# Altium project Dogfish3D.PrjPcb
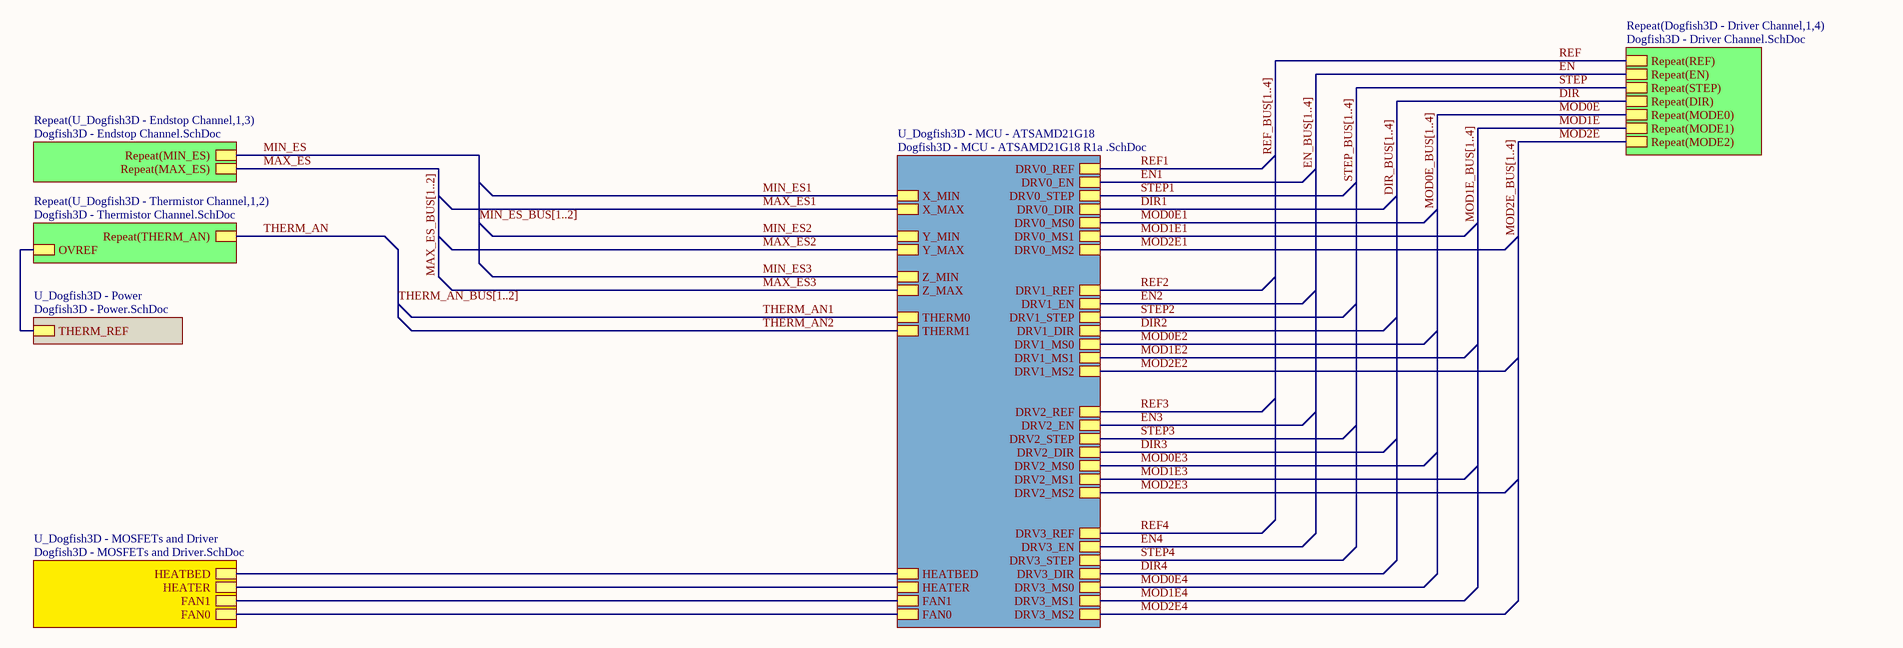
[diagram p0: Dogfish3D - Systyem.SchDoc]
7 sheets, 228 parts. Net scope: hierarchical (ports join the sheet entries above them; power ports are global).
Board file: Dogfish3D R1.0.PcbDoc
Sheets:
  Dogfish3D - Systyem.SchDoc
    Dogfish3D - Driver Channel1 = Dogfish3D - Driver Channel.SchDoc
    Dogfish3D - Driver Channel2 = Dogfish3D - Driver Channel.SchDoc
    Dogfish3D - Driver Channel3 = Dogfish3D - Driver Channel.SchDoc
    Dogfish3D - Driver Channel4 = Dogfish3D - Driver Channel.SchDoc
    U_Dogfish3D - Endstop Channel1 = Dogfish3D - Endstop Channel.SchDoc
    U_Dogfish3D - Endstop Channel2 = Dogfish3D - Endstop Channel.SchDoc
    U_Dogfish3D - Endstop Channel3 = Dogfish3D - Endstop Channel.SchDoc
    U_Dogfish3D - MOSFETs and Driver = Dogfish3D - MOSFETs and Driver.SchDoc
    U_Dogfish3D - Power = Dogfish3D - Power.SchDoc
    U_Dogfish3D - Thermistor Channel1 = Dogfish3D - Thermistor Channel.SchDoc
    U_Dogfish3D - Thermistor Channel2 = Dogfish3D - Thermistor Channel.SchDoc
    U_Dogfish3D - MCU - ATSAMD21G18 = Dogfish3D - MCU - ATSAMD21G18 R1a .SchDoc

## Sheet Dogfish3D - Systyem.SchDoc
size B

### Sub-sheets
Repeat(Dogfish3D - Driver Channel,1,4) = Dogfish3D - Driver Channel.SchDoc: Repeat(REF), Repeat(EN), Repeat(STEP), Repeat(DIR), Repeat(MODE0), Repeat(MODE1), Repeat(MODE2)
Repeat(U_Dogfish3D - Endstop Channel,1,3) = Dogfish3D - Endstop Channel.SchDoc: Repeat(MAX_ES), Repeat(MIN_ES)
Repeat(U_Dogfish3D - Thermistor Channel,1,2) = Dogfish3D - Thermistor Channel.SchDoc: OVREF, Repeat(THERM_AN)
U_Dogfish3D - MCU - ATSAMD21G18 = Dogfish3D - MCU - ATSAMD21G18 R1a .SchDoc: DRV0_EN, DRV0_DIR, DRV0_STEP, DRV0_MS0, DRV0_MS1, DRV0_MS2, DRV0_REF, DRV1_EN, DRV1_DIR, DRV1_STEP, DRV1_MS0, DRV1_MS1, DRV1_MS2, DRV1_REF, DRV2_EN, DRV2_DIR, DRV2_STEP, DRV2_MS0, DRV2_MS1, DRV2_MS2, DRV2_REF, DRV3_EN, DRV3_DIR, DRV3_STEP, DRV3_MS0, DRV3_MS1, DRV3_MS2, DRV3_REF, THERM0, THERM1, X_MAX, X_MIN, Y_MAX, Y_MIN, Z_MAX, Z_MIN, FAN0, FAN1, HEATER, HEATBED
U_Dogfish3D - MOSFETs and Driver = Dogfish3D - MOSFETs and Driver.SchDoc: FAN0, FAN1, HEATER, HEATBED
U_Dogfish3D - Power = Dogfish3D - Power.SchDoc: THERM_REF

### Nets
DIR: sheet Repeat(Dogfish3D - Driver Channel,1,4)/Repeat(DIR)
EN: sheet Repeat(Dogfish3D - Driver Channel,1,4)/Repeat(EN)
MAX_ES: sheet Repeat(U_Dogfish3D - Endstop Channel,1,3)/Repeat(MAX_ES)
MIN_ES: sheet Repeat(U_Dogfish3D - Endstop Channel,1,3)/Repeat(MIN_ES)
MOD0E: sheet Repeat(Dogfish3D - Driver Channel,1,4)/Repeat(MODE0)
MOD1E: sheet Repeat(Dogfish3D - Driver Channel,1,4)/Repeat(MODE1)
MOD2E: sheet Repeat(Dogfish3D - Driver Channel,1,4)/Repeat(MODE2)
PWM0: sheet U_Dogfish3D - MOSFETs and Driver/FAN0, sheet U_Dogfish3D - MCU - ATSAMD21G18/FAN0
PWM1: sheet U_Dogfish3D - MOSFETs and Driver/FAN1, sheet U_Dogfish3D - MCU - ATSAMD21G18/FAN1
PWM2: sheet U_Dogfish3D - MOSFETs and Driver/HEATER, sheet U_Dogfish3D - MCU - ATSAMD21G18/HEATER
PWM3: sheet U_Dogfish3D - MOSFETs and Driver/HEATBED, sheet U_Dogfish3D - MCU - ATSAMD21G18/HEATBED
REF: sheet Repeat(Dogfish3D - Driver Channel,1,4)/Repeat(REF)
STEP: sheet Repeat(Dogfish3D - Driver Channel,1,4)/Repeat(STEP)
THERM_AN: sheet Repeat(U_Dogfish3D - Thermistor Channel,1,2)/Repeat(THERM_AN)
NetD3A_2: sheet U_Dogfish3D - Power/THERM_REF, sheet Repeat(U_Dogfish3D - Thermistor Channel,1,2)/OVREF

### Buses and harness runs
bus DIR_BUS[1..4]
bus EN_BUS[1..4]
bus MAX_ES_BUS[1..2]
bus MIN_ES_BUS[1..2]
bus MOD0E_BUS[1..4]
bus MOD1E_BUS[1..4]
bus MOD2E_BUS[1..4]
bus REF_BUS[1..4]
bus STEP_BUS[1..4]
bus THERM_AN_BUS[1..2]

## Sheet Dogfish3D - Driver Channel.SchDoc
size A
Used 4 times, as channels Dogfish3D - Driver Channel1, Dogfish3D - Driver Channel2, Dogfish3D - Driver Channel3, Dogfish3D - Driver Channel4. Parts and nets are listed once, with the designators drawn on the sheet.
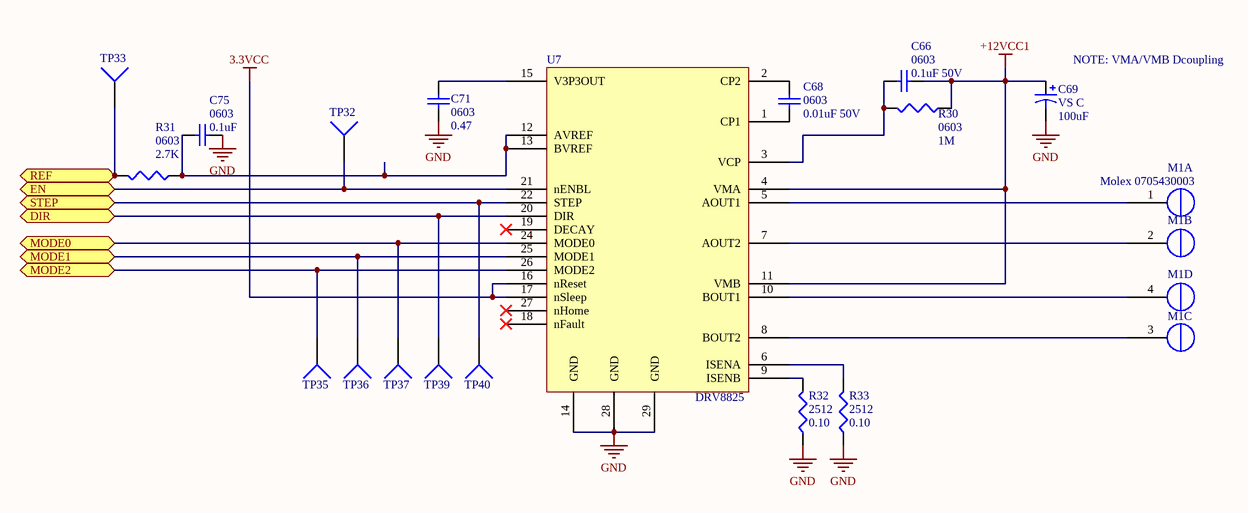
[diagram p1: Dogfish3D - Driver Channel.SchDoc]

### Parts
C66  0603  value 0.1uF 50V  [1608[0603]]
C68  0603  value 0.01uF 50V  [1608[0603]]
C69  VS C  value 100uF  [Panasonic VS C]
C71  0603  value 0.47  [1608[0603]]
C75  0603  value 0.1uF  [1608[0603]]
M1  Molex 0705430003  [4POL254]  (parts A,B,C,D of 4)
R30  0603  value 1M  [J1-0603]
R31  0603  value 2.7K  [J1-0603]
R32  2512  value 0.10  [Resistor2512]
R33  2512  value 0.10  [Resistor2512]
TP32  TP4  [TP-2]  (value not drawn)
TP33  TP4  [TP-2]  (value not drawn)
TP35  TP4  [TP-2]  (value not drawn)
TP36  TP4  [TP-2]  (value not drawn)
TP37  TP4  [TP-2]  (value not drawn)
TP39  TP4  [TP-2]  (value not drawn)
TP40  TP4  [TP-2]  (value not drawn)
U7  DRV8825  [DRV8825]

### Ports
DIR, EN, MODE0, MODE1, MODE2, REF, STEP

### Nets
3.3VCC: U7.16(nReset) U7.17(nSleep)
+12VCC1: C66.1 C69.1 R30.1 U7.4(VMA) U7.11(VMB)
GND: C69.2 C71.1 C75.1 R32.1 R33.1 U7.14(GND) U7.28(GND) U7.29(GND)
DIR: TP39.1 U7.20(DIR) ; port DIR
EN: TP32.1 U7.21(nENBL) ; port EN
MODE0: TP37.1 U7.24(MODE0) ; port MODE0
MODE1: TP36.1 U7.25(MODE1) ; port MODE1
MODE2: TP35.1 U7.26(MODE2) ; port MODE2
REF: R31.2 TP33.1 ; port REF
STEP: TP40.1 U7.22(STEP) ; port STEP
NetC66_2: C66.2 R30.2 U7.3(VCP)
NetC68_1: C68.1 U7.1(CP1)
NetC68_2: C68.2 U7.2(CP2)
NetC71_2: C71.2 U7.15(V3P3OUT)
NetC75_2: C75.2 R31.1 U7.12(AVREF) U7.13(BVREF)
NetM1_1: M1.1(OUT2B) U7.5(AOUT1)
NetM1_2: M1.2(OUT2A) U7.7(AOUT2)
NetM1_3: M1.3(OUT1A) U7.8(BOUT2)
NetM1_4: M1.4(OUT1B) U7.10(BOUT1)
NetR32_2: R32.2 U7.9(ISENB)
NetR33_2: R33.2 U7.6(ISENA)

Not connected (* = marked no-connect by the designer): U7 18(nFault)* 19(DECAY)* 23(NC) 27(nHome)*

### Channels
Dogfish3D - Driver Channel1: designators end in A; ports DIR=DIR1 EN=EN1 MODE0=MOD0E1 MODE1=MOD1E1 MODE2=MOD2E1 REF=REF1 STEP=STEP1
Dogfish3D - Driver Channel2: designators end in B; ports DIR=DIR2 EN=EN2 MODE0=MOD0E2 MODE1=MOD1E2 MODE2=MOD2E2 REF=REF2 STEP=STEP2
Dogfish3D - Driver Channel3: designators end in C; ports DIR=DIR3 EN=EN3 MODE0=MOD0E3 MODE1=MOD1E3 MODE2=MOD2E3 REF=REF3 STEP=STEP3
Dogfish3D - Driver Channel4: designators end in D; ports DIR=DIR4 EN=EN4 MODE0=MOD0E4 MODE1=MOD1E4 MODE2=MOD2E4 REF=E0_DRV_REF STEP=STEP4

### Notes on the sheet
- (near C69) NOTE: VMA/VMB Dcoupling

### Library data of the parts
C66 C68 C71 C75 = Cap Semi: Capacitor (Semiconductor SIM Model); Published: 8-Jun-2000; LatestRevisionDate: 29-May-2009; LatestRevisionNote: IPC-7351 Footprint Added.; PackageReference: C1206; Publisher: Altium Limited; PackageDescription: Chip Capacitor
C69 = Cap Pol1: Polarized Capacitor (Radial); Published: 8-Jun-2000; LatestRevisionDate: 17-Jul-2002; LatestRevisionNote: Re-released for DXP Platform.; PackageReference: RB7.6-15; Publisher: Altium Limited; PackageDescription: Polarized Capacitor (Radial); 2 Leads
M1 = Molex 0705430003 Alt: Molex 4 Pin Clip Connector
R30-R33 = Res3: Resistor; Published: 8-Jun-2000; LatestRevisionDate: 29-May-2009; LatestRevisionNote: IPC-7351 Footprint Added.; PackageReference: J1-0603; Publisher: Altium Limited; PackageDescription: Chip Resistor
TP32 TP33 TP35-TP37 TP39 TP40 = Socket: LatestRevisionDate: 17-Jul-2002; LatestRevisionNote: Re-released for DXP Platform.; Publisher: Altium Limited
U7 = DRV8825: DRV8825 Ti Stepper Driver

## Sheet Dogfish3D - Endstop Channel.SchDoc
size A
Used 3 times, as channels U_Dogfish3D - Endstop Channel1, U_Dogfish3D - Endstop Channel2, U_Dogfish3D - Endstop Channel3. Parts and nets are listed once, with the designators drawn on the sheet.
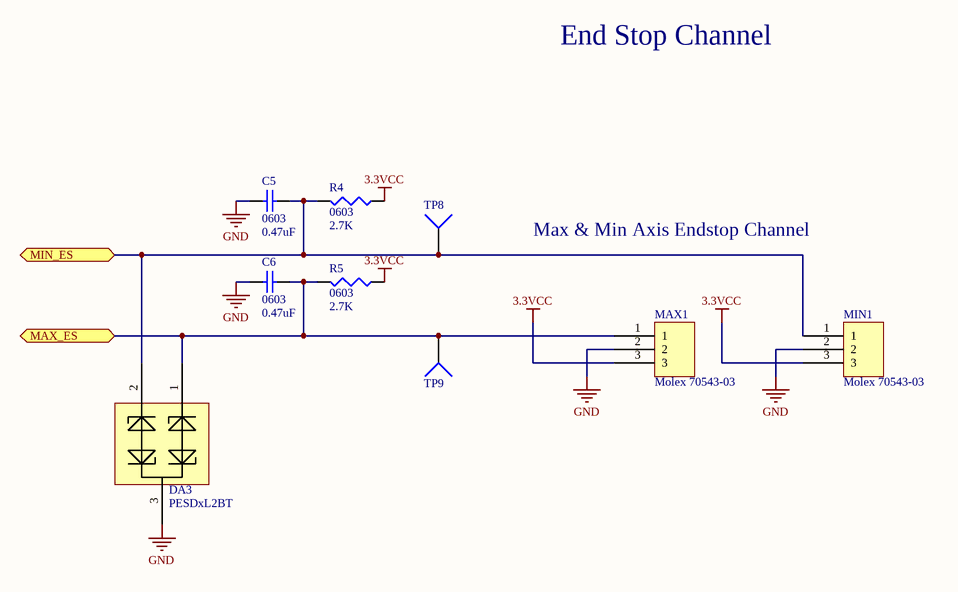
[diagram p2: Dogfish3D - Endstop Channel.SchDoc]

### Parts
C5  0603  value 0.47uF  [1608[0603]]
C6  0603  value 0.47uF  [1608[0603]]
DA3  PESDxL2BT  [SOT95P230X110-3N]
MAX1  Molex 70543-03  [70543-03]
MIN1  Molex 70543-03  [70543-03]
R4  0603  value 2.7K  [J1-0603]
R5  0603  value 2.7K  [J1-0603]
TP8  TP4  [TP-2]  (value not drawn)
TP9  TP4  [TP-2]  (value not drawn)

### Ports
MAX_ES, MIN_ES

### Nets
3.3VCC: MAX1.3 MIN1.3 R4.1 R5.1
GND: C5.2 C6.2 DA3.3 MAX1.2 MIN1.2
MAX_ES: C6.1 DA3.1 MAX1.1 R5.2 TP9.1 ; port MAX_ES
MIN_ES: C5.1 DA3.2 MIN1.1 R4.2 TP8.1 ; port MIN_ES

### Channels
U_Dogfish3D - Endstop Channel1: designators end in A; ports MAX_ES=MAX_ES1 MIN_ES=MIN_ES1
U_Dogfish3D - Endstop Channel2: designators end in B; ports MAX_ES=MAX_ES2 MIN_ES=MIN_ES2
U_Dogfish3D - Endstop Channel3: designators end in C; ports MAX_ES=MAX_ES3 MIN_ES=MIN_ES3

### Notes on the sheet
- End Stop Channel
- Max & Min Axis Endstop Channel

### Library data of the parts
C5 C6 = Cap Semi: Capacitor (Semiconductor SIM Model); Published: 8-Jun-2000; LatestRevisionDate: 29-May-2009; LatestRevisionNote: IPC-7351 Footprint Added.; PackageReference: C1206; Publisher: Altium Limited; PackageDescription: Chip Capacitor
DA3 = PESDxL2BT: PESDxL2BT TVS Diode Array 2x
MAX1 MIN1 = Molex Endstop
R4 R5 = Res3: Resistor; Published: 8-Jun-2000; LatestRevisionDate: 29-May-2009; LatestRevisionNote: IPC-7351 Footprint Added.; PackageReference: J1-0603; Publisher: Altium Limited; PackageDescription: Chip Resistor
TP8 TP9 = Socket: LatestRevisionDate: 17-Jul-2002; LatestRevisionNote: Re-released for DXP Platform.; Publisher: Altium Limited

## Sheet Dogfish3D - MOSFETs and Driver.SchDoc
size A
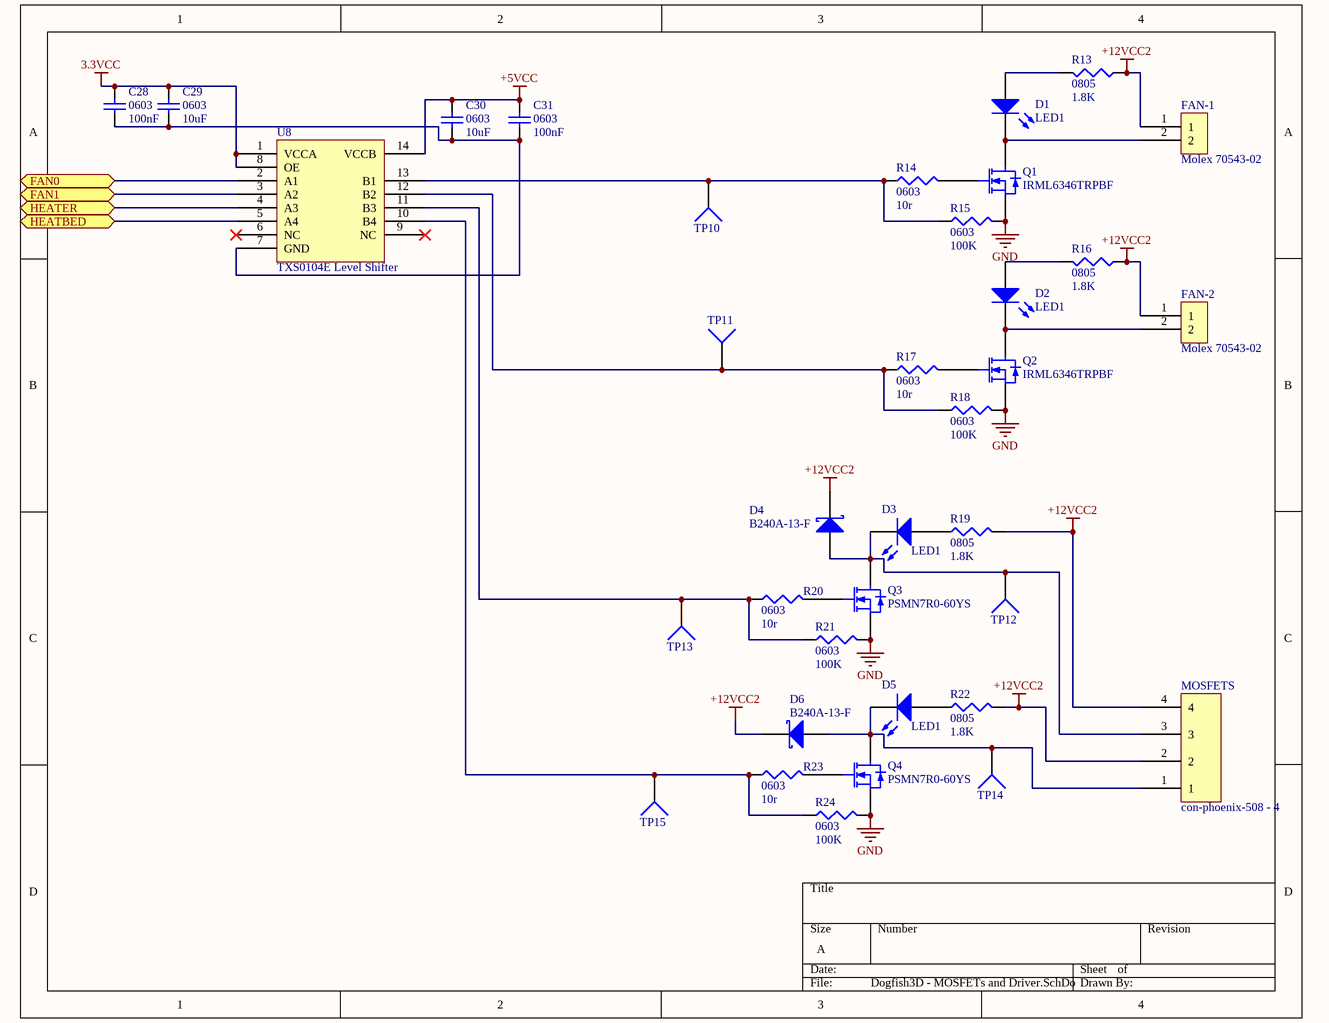
[diagram p3: Dogfish3D - MOSFETs and Driver.SchDoc]

### Parts
(Parts that share a designator on the sheet are numbered #1, #2 ... from top to bottom, then left to right.)
C28  0603  value 100nF  [1608[0603]]
C29  0603  value 10uF  [1608[0603]]
C30  0603  value 10uF  [1608[0603]]
C31  0603  value 100nF  [1608[0603]]
D1  LED1  [SM 0805 polarized]
D2  LED1  [SM 0805 polarized]
D3  LED1  [SM 0805 polarized]
D4  B240A-13-F  [SK310A-TP]
D5  LED1  [SM 0805 polarized]
D6  B240A-13-F  [SK310A-TP]
FAN-1  Molex 70543-02  [70543-02]
FAN-2  Molex 70543-02  [70543-02]
MOSFETS  con-phoenix-508 - 4  [MSTBV4]
Q1  IRML6346TRPBF  [IRLML6346]
Q2  IRML6346TRPBF  [IRLML6346]
Q3  PSMN7R0-60YS  [PSMN7R0-60YS]
Q4  PSMN7R0-60YS  [PSMN7R0-60YS]
R13  0805  value 1.8K  [SM 0805 - gap trimmed]
R14  0603  value 10r  [J1-0603]
R15  0603  value 100K  [J1-0603]
R16  0805  value 1.8K  [SM 0805 - gap trimmed]
R17  0603  value 10r  [J1-0603]
R18  0603  value 100K  [J1-0603]
R19  0805  value 1.8K  [SM 0805 - gap trimmed]
R20  0603  value 10r  [J1-0603]
R21  0603  value 100K  [J1-0603]
R22  0805  value 1.8K  [SM 0805 - gap trimmed]
R23  0603  value 10r  [J1-0603]
R24#1  0603  value 100K  [J1-0603]
TP10  TP4  [TP-2]  (value not drawn)
TP11  TP4  [TP-2]  (value not drawn)
TP12  TP4  [TP-2]  (value not drawn)
TP13  TP4  [TP-2]  (value not drawn)
TP14  TP4  [TP-2]  (value not drawn)
TP15  TP4  [TP-2]  (value not drawn)
U8#1  TXS0104E Level Shifter  [RGY  (S-PVQFN-N14)]

### Ports
FAN0, FAN1, HEATBED, HEATER

### Nets
3.3VCC: C28.2 C29.2 U8#1.1(VCCA) U8#1.8(OE)
+5VCC: C30.2 C31.2 U8#1.14(VCCB)
+12VCC2: D4.2(K) D6.2(K) FAN-1.1 FAN-2.1 MOSFETS.2 MOSFETS.4 R13.1 R16.1 R19.2 R22.2
GND: Q1.2(S) Q2.2(S) Q3.1(S) Q3.2(S) Q3.3(S) Q4.1(S) Q4.2(S) Q4.3(S) R15.2 R18.2 R21.2 R24#1.2
PWM0: U8#1.2(A1) ; port FAN0
PWM1: U8#1.3(A2) ; port FAN1
PWM2: U8#1.4(A3) ; port HEATER
PWM3: U8#1.5(A4) ; port HEATBED
NetC28_1: C28.1 C29.1 C30.1 C31.1 U8#1.7(GND)
NetD1_1: D1.1(A) FAN-1.2 Q1.3(D)
NetD1_2: D1.2(K) R13.2
NetD2_1: D2.1(A) FAN-2.2 Q2.3(D)
NetD2_2: D2.2(K) R16.2
NetD3_1: D3.1(A) D4.1(A) MOSFETS.3 Q3.5(D) TP12.1
NetD3_2: D3.2(K) R19.1
NetD5_1: D5.1(A) D6.1(A) MOSFETS.1 Q4.5(D) TP14.1
NetD5_2: D5.2(K) R22.1
NetQ1_1: Q1.1(G) R14.2
NetQ2_1: Q2.1(G) R17.2
NetQ3_4: Q3.4(G) R20.2
NetQ4_4: Q4.4(G) R23.2
NetR14_1: R14.1 R15.1 TP10.1 U8#1.13(B1)
NetR17_1: R17.1 R18.1 TP11.1 U8#1.12(B2)
NetR20_1: R20.1 R21.1 TP13.1 U8#1.11(B3)
NetR23_1: R23.1 R24#1.1 TP15.1 U8#1.10(B4)

Not connected (* = marked no-connect by the designer): U8#1 6(NC)* 9(NC)*

### Library data of the parts
C28-C31 = Cap Semi: Capacitor (Semiconductor SIM Model); Published: 8-Jun-2000; LatestRevisionDate: 29-May-2009; LatestRevisionNote: IPC-7351 Footprint Added.; PackageReference: C1206; Publisher: Altium Limited; PackageDescription: Chip Capacitor
D1-D3 D5 = LED1: Typical RED GaAs LED; Published: 8-Jun-2000; LatestRevisionDate: 08-Jul-2005; LatestRevisionNote: Mech Layer 1 removed.; PackageReference: LED-1; Publisher: Altium Limited; PackageDescription: LED; 2 Leads
D4 D6 = D Schottky: Schottky Diode; Published: 8-Jun-2000; LatestRevisionDate: 17-Jul-2002; LatestRevisionNote: Re-released for DXP Platform.; PackageReference: SMB; Publisher: Altium Limited; PackageDescription: DO-214-AA/SMB; 2 C-Bend Leads; Body 5.3 x 3.6 mm, inc. leads (LxW); Code_JEDEC: DO-214-AA
MOSFETS = con-phoenix-508_4
Q1 Q2 = IRML6346TRPBF: N-Channel MOSFET; Published: 8-Jun-2000; LatestRevisionDate: 17-Jul-2002; LatestRevisionNote: Re-released for DXP Platform.; PackageVersion: 1995/1996; PackageReference: E3; Publisher: Altium Limited; PackageDescription: TO, Flat Index; 3 In-Line, Axial Leads; Body Dia. 4.6mm; Lead Dia. 0.5 mm (max)
Q3 Q4 = PSMN7R0-60YS: N-Channel MOSFET; Published: 8-Jun-2000; LatestRevisionDate: 17-Jul-2002; LatestRevisionNote: Re-released for DXP Platform.; PackageVersion: 1995/1996; PackageReference: E3; Publisher: Altium Limited; PackageDescription: TO, Flat Index; 3 In-Line, Axial Leads; Body Dia. 4.6mm; Lead Dia. 0.5 mm (max)
R13-R23 R24#1 = Res3: Resistor; Published: 8-Jun-2000; LatestRevisionDate: 29-May-2009; LatestRevisionNote: IPC-7351 Footprint Added.; PackageReference: J1-0603; Publisher: Altium Limited; PackageDescription: Chip Resistor
TP10-TP15 = Socket: LatestRevisionDate: 17-Jul-2002; LatestRevisionNote: Re-released for DXP Platform.; Publisher: Altium Limited
U8#1 = TXS0104E: TXS0104E - Bidriectional Opendrain/pushpull level shift

## Sheet Dogfish3D - Power.SchDoc
size A
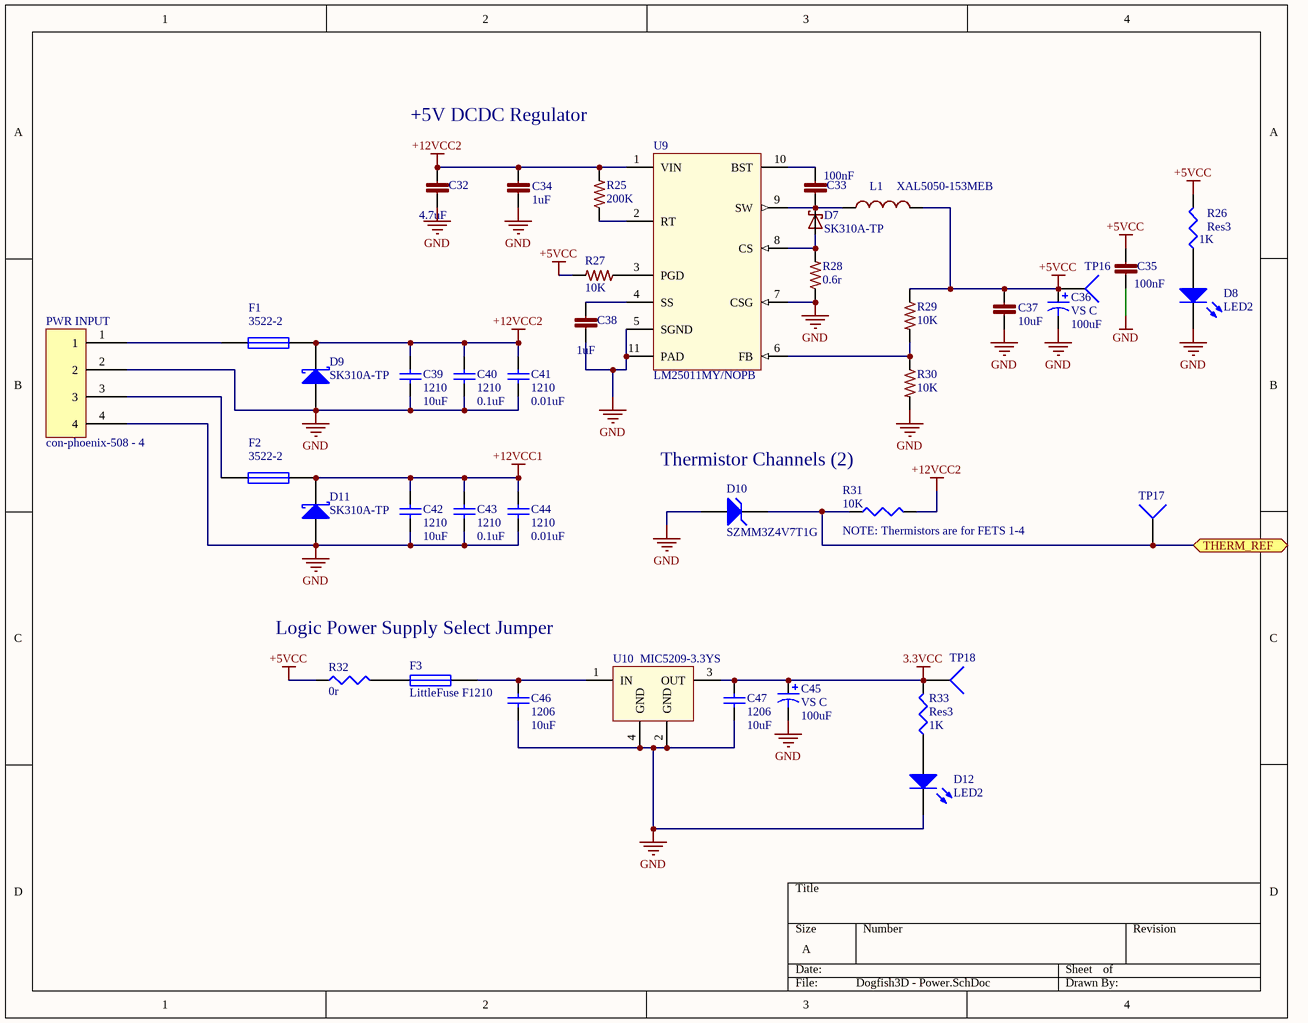
[diagram p4: Dogfish3D - Power.SchDoc]

### Parts
(Parts that share a designator on the sheet are numbered #1, #2 ... from top to bottom, then left to right.)
C32  4.7uF  [C1206]
C33  100nF  [C0603]
C34  1uF  [C0805]
C35#1  100nF  [C0603]
C36#1  VS C  value 100uF  [Panasonic VS C]
C37#1  10uF  [C0805]
C38#1  1uF  [C0402]
C39#1  1210  value 10uF  [C1210]
C40#1  1210  value 0.1uF  [C1210]
C41  1210  value 0.01uF  [C1210]
C42  1210  value 10uF  [C1210]
C43  1210  value 0.1uF  [C1210]
C44  1210  value 0.01uF  [C1210]
C45  VS C  value 100uF  [Panasonic VS C]
C46  1206  value 10uF  [C1206]
C47  1206  value 10uF  [C1206]
D7  SK310A-TP  [SMA-SM]
D8  LED2  [SM 0805 polarized]
D9  SK310A-TP  [SK310A-TP]
D10  SZMM3Z4V7T1G  [SZMM3Z4V7T1G]
D11  SK310A-TP  [SK310A-TP]
D12  LED2  [SM 0805 polarized]
F1  3522-2  [3522-2 - WAVE SOLDER]
F2  3522-2  [3522-2 - WAVE SOLDER]
F3  LittleFuse F1210  [F1210_M]
L1  XAL5050-153MEB  [XAL50xx-153]
PWR_INPUT  con-phoenix-508 - 4  [MSTBV4]
R25  200K  [R0402]
R26  Res3  value 1K  [SM 0805 - gap trimmed]
R27  10K  [R0603]
R28  0.6r  [2512R-0.55]
R29  10K  [R0603]
R30  10K  [R0603]
R31  value 10K  [J1-0603]  (hidden comment: Res3)
R32  value 0r  [SM 0805 - gap trimmed]  (hidden comment: Res3)
R33  Res3  value 1K  [SM 0805 - gap trimmed]
TP16  TP4  [TP-2]  (value not drawn)
TP17  TP4  [TP-2]  (value not drawn)
TP18  TP4  [TP-2]  (value not drawn)
U9#1  LM25011MY/NOPB  [VSSOP10]
U10#1  MIC5209-3.3YS  [SOT230P700X190-4N]

### Ports
THERM_REF

### Nets
3.3VCC: C45.1 C47.2 R33.2 TP18.1 U10#1.3(OUT)
+5VCC: C35#1.1 C36#1.1 C37#1.1 L1.2 R26.2 R27.2 R29.1 R32.1 TP16.1
+12VCC1: C42.2 C43.2 C44.2 D11.2(K) F2.2
+12VCC2: C32.1 C34.1 C39#1.2 C40#1.2 C41.2 D9.2(K) F1.2 R25.2 R31.2 U9#1.1(VIN)
GND: C32.2 C34.2 C35#1.2 C36#1.2 C37#1.2 C38#1.2 C39#1.1 C40#1.1 C41.1 C42.1 C43.1 C44.1 C45.2 C46.1 C47.1 D8.1(A) D9.1(A) D10.1(A) D11.1(A) D12.1(A) PWR_INPUT.2 PWR_INPUT.4 R28.1 R30.2 U9#1.5(SGND) U9#1.7(CSG) U9#1.11(PAD) U10#1.2(GND) U10#1.4(GND)
NetC33_1: C33.1 U9#1.10(BST)
NetC33_2: C33.2 D7.C L1.1 U9#1.9(SW)
NetC38#1_1: C38#1.1 U9#1.4(SS)
NetC46_2: C46.2 F3.1 U10#1.1(IN)
NetD3A_2: D10.2(K) R31.1 TP17.1 ; port THERM_REF
NetD7_A: D7.A R28.2 U9#1.8(CS)
NetD8_2: D8.2(K) R26.1
NetD12_2: D12.2(K) R33.1
NetF1_1: F1.1 PWR_INPUT.1
NetF2_1: F2.1 PWR_INPUT.3
NetF3_2: F3.2 R32.2
NetR25_1: R25.1 U9#1.2(RT)
NetR27_1: R27.1 U9#1.3(PGD)
NetR29_2: R29.2 R30.1 U9#1.6(FB)

### Notes on the sheet
- +5V DCDC Regulator
- Thermistor Channels (2)
- (near R31) NOTE: Thermistors are for FETS 1-4
- Logic Power Supply Select Jumper

### Library data of the parts
C32 = C1206C475K5PACTU: CAP CER 1206 4.7uF 50V 10% X5R; LastRevisionNote: ImportComponents; Published: 23-Apr-2014; Publisher: UltiMachine; LastRevisionDate: 23-Apr-2014; ManufacturerPartNumber: C1206C475K5PACTU; VALUE: 4.7uF
C33 C35#1 = C0603C104K5RACTU: CAP CER 0603 100nF 50V 10% X7R; LastRevisionNote: ImportComponents; Published: 23-Apr-2014; Publisher: UltiMachine; LastRevisionDate: 23-Apr-2014; ManufacturerPartNumber: C0603C104K5RACTU; VALUE: 100nF
C34 = GRM21BR71H105KA12L: CAP CER 0805 1uF 50V 10% X7R; LastRevisionNote: ImportComponents; Published: 23-Apr-2014; Publisher: UltiMachine; LastRevisionDate: 23-Apr-2014; ManufacturerPartNumber: GRM21BR71H105KA12L; VALUE: 1uF
C36#1 C45 = Cap Pol3: Polarized Capacitor (Surface Mount); Published: 8-Jun-2000; LatestRevisionDate: 29-May-2009; LatestRevisionNote: IPC-7351 Footprint Added.; PackageReference: C0805; Publisher: Altium Limited; PackageDescription: Chip Capacitor
C37#1 = C0805C106K8PACTU: CAP CER 0805 10uF 10V 10% X5R; LastRevisionNote: ImportComponents; Published: 23-Apr-2014; Publisher: UltiMachine; LastRevisionDate: 23-Apr-2014; ManufacturerPartNumber: C0805C106K8PACTU; VALUE: 10uF
C38#1 = GRM155R60J105KE19D: CAP CER 0402 1uF 6.3V 10% X5R; LastRevisionNote: ImportComponents; Published: 23-Apr-2014; Publisher: UltiMachine; LastRevisionDate: 23-Apr-2014; ManufacturerPartNumber: GRM155R60J105KE19D; VALUE: 1uF
C39#1 C40#1 C41-C44 C46 C47 = Cap Semi: Capacitor (Semiconductor SIM Model); Published: 8-Jun-2000; LatestRevisionDate: 29-May-2009; LatestRevisionNote: IPC-7351 Footprint Added.; PackageReference: C1206; Publisher: Altium Limited; PackageDescription: Chip Capacitor
D7 = SK310A: DIODE Schottky 3A SMA; LastRevisionNote: ImportComponents; LastRevisionDate: 23-Apr-2014; ManufacturerPartNumber: SK310A; Published: 23-Apr-2014; Publisher: UltiMachine
D8 D12 = LED2: Typical RED, GREEN, YELLOW, AMBER GaAs LED; Published: 8-Jun-2000; LatestRevisionDate: 17-Jul-2002; LatestRevisionNote: Re-released for DXP Platform.; PackageVersion: Feb-2002; PackageReference: 3.2X1.6X1.1; Publisher: Altium Limited; PackageDescription: SM LED; 2 Flat Leads
D9 D11 = D Schottky: Schottky Diode; Published: 8-Jun-2000; LatestRevisionDate: 17-Jul-2002; LatestRevisionNote: Re-released for DXP Platform.; PackageReference: SMB; Publisher: Altium Limited; PackageDescription: DO-214-AA/SMB; 2 C-Bend Leads; Body 5.3 x 3.6 mm, inc. leads (LxW); Code_JEDEC: DO-214-AA
D10 = D Zener: Zener Diode; Published: 8-Jun-2000; LatestRevisionDate: 17-Jul-2002; LatestRevisionNote: Re-released for DXP Platform.; PackageReference: DIODE-0.7; Publisher: Altium Limited; PackageDescription: Diode, Thru-Hole; 2 Leads; 0.7 in Pin Spacing
F1-F3 = Fuse 1: Fuse; Published: 8-Jun-2000; LatestRevisionDate: 17-Jul-2002; LatestRevisionNote: Re-released for DXP Platform.; PackageReference: PIN-W2/E2.8; Publisher: Altium Limited; PackageDescription: Thru-Hole; 2 Leads
L1 = XAL5050-153MEB: IND 15uH 3.9A 20%; LastRevisionNote: ImportComponents; Published: 23-Apr-2014; Publisher: UltiMachine; LastRevisionDate: 23-Apr-2014; ManufacturerPartNumber: XAL5050-153MEB; Value: XAL5050-153MEB
PWR_INPUT = con-phoenix-508_4
R25 = CRCW0402200KFKED: RES 0402 22r 63mW 1%; LastRevisionNote: ImportComponents; Published: 23-Apr-2014; Publisher: UltiMachine; LastRevisionDate: 23-Apr-2014; ManufacturerPartNumber: CRCW0402200KFKED; VALUE: 200K
R26 R31-R33 = Res3: Resistor; Published: 8-Jun-2000; LatestRevisionDate: 29-May-2009; LatestRevisionNote: IPC-7351 Footprint Added.; PackageReference: J1-0603; Publisher: Altium Limited; PackageDescription: Chip Resistor
R27 R29 R30 = ERJ-3EKF1002V: RES 0603 10K 100mW 1%; LastRevisionNote: ImportComponents; Published: 23-Apr-2014; Publisher: UltiMachine; LastRevisionDate: 23-Apr-2014; ManufacturerPartNumber: ERJ-3EKF1002V; VALUE: 10K
R28 = RL2512FK-070R06L: RES 0.06 OHM 1W 1% 2512 SMD; LastRevisionNote: ImportComponents; Published: 23-Apr-2014; Publisher: UltiMachine; LastRevisionDate: 23-Apr-2014; ManufacturerPartNumber: RL2512FK-070R06L; VALUE: 0.6r
TP16-TP18 = Socket: LatestRevisionDate: 17-Jul-2002; LatestRevisionNote: Re-released for DXP Platform.; Publisher: Altium Limited
U9#1 = LM25011: REG BUCK; Value: LM25011MY/NOPB

## Sheet Dogfish3D - Thermistor Channel.SchDoc
size A
Used 2 times, as channels U_Dogfish3D - Thermistor Channel1, U_Dogfish3D - Thermistor Channel2. Parts and nets are listed once, with the designators drawn on the sheet.
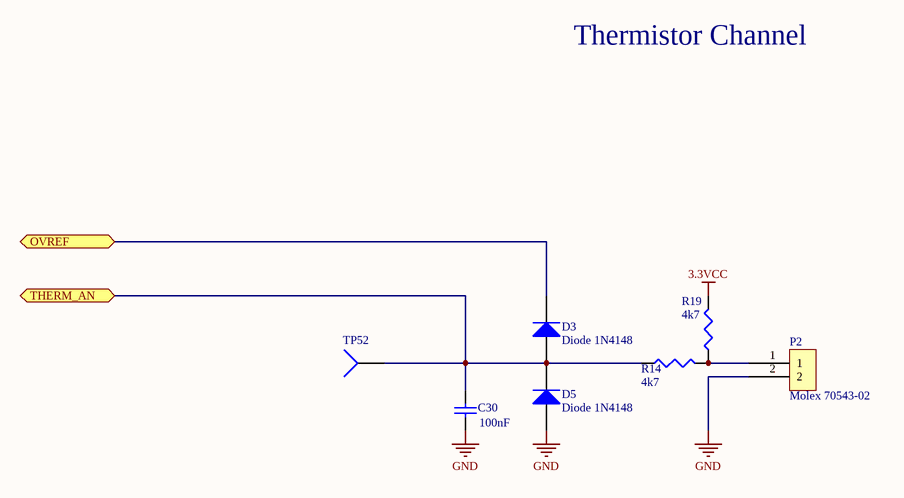
[diagram p5: Dogfish3D - Thermistor Channel.SchDoc]

### Parts
C30  value 100nF  [1608[0603]]  (hidden comment: Cap Semi)
D3  Diode 1N4148  [1N4148WT]
D5  Diode 1N4148  [1N4148WT]
P2  Molex 70543-02  [70543-02]
R14  value 4k7  [J1-0603]  (hidden comment: Res3)
R19  value 4k7  [J1-0603]  (hidden comment: Res3)
TP52  TP4  [TP-2]  (value not drawn)

### Ports
OVREF, THERM_AN

### Nets
3.3VCC: R19.2
GND: C30.1 D5.1(A) P2.2
OVREF: D3.2(K) ; port OVREF
THERM_AN: C30.2 D3.1(A) D5.2(K) R14.1 TP52.1 ; port THERM_AN
NetP2_1: P2.1 R14.2 R19.1

### Channels
U_Dogfish3D - Thermistor Channel1: designators end in A; ports OVREF=NetD3A_2 THERM_AN=THERM_AN1
U_Dogfish3D - Thermistor Channel2: designators end in B; ports OVREF=NetD3A_2 THERM_AN=THERM_AN2

### Notes on the sheet
- Thermistor Channel

### Library data of the parts
C30 = Cap Semi: Capacitor (Semiconductor SIM Model); Published: 8-Jun-2000; LatestRevisionDate: 29-May-2009; LatestRevisionNote: IPC-7351 Footprint Added.; PackageReference: C1206; Publisher: Altium Limited; PackageDescription: Chip Capacitor
D3 D5 = Diode 1N4148: High Conductance Fast Diode; Published: 8-Jun-2000; LatestRevisionDate: 17-Jul-2002; LatestRevisionNote: Re-released for DXP Platform.; DatasheetVersion: 1997; PackageReference: DO-35; Publisher: Altium Limited; PackageDescription: Diode, Axial; Body 3.8 x 1.9 mm (LxDia. max), Lead Dia. 0.53 mm (max); Code_JEDEC: DO-204-AH; ComponentLink1Description: Manufacturer Link; ComponentLink1URL: http://www.fairchildsemi.com/; ComponentLink2Description: Datasheet; ComponentLink2URL: http://www.fairchildsemi.com/ds/1N%2F1N4148.pdf
R14 R19 = Res3: Resistor; Published: 8-Jun-2000; LatestRevisionDate: 29-May-2009; LatestRevisionNote: IPC-7351 Footprint Added.; PackageReference: J1-0603; Publisher: Altium Limited; PackageDescription: Chip Resistor
TP52 = Socket: LatestRevisionDate: 17-Jul-2002; LatestRevisionNote: Re-released for DXP Platform.; Publisher: Altium Limited

## Sheet Dogfish3D - MCU - ATSAMD21G18 R1a .SchDoc
size B
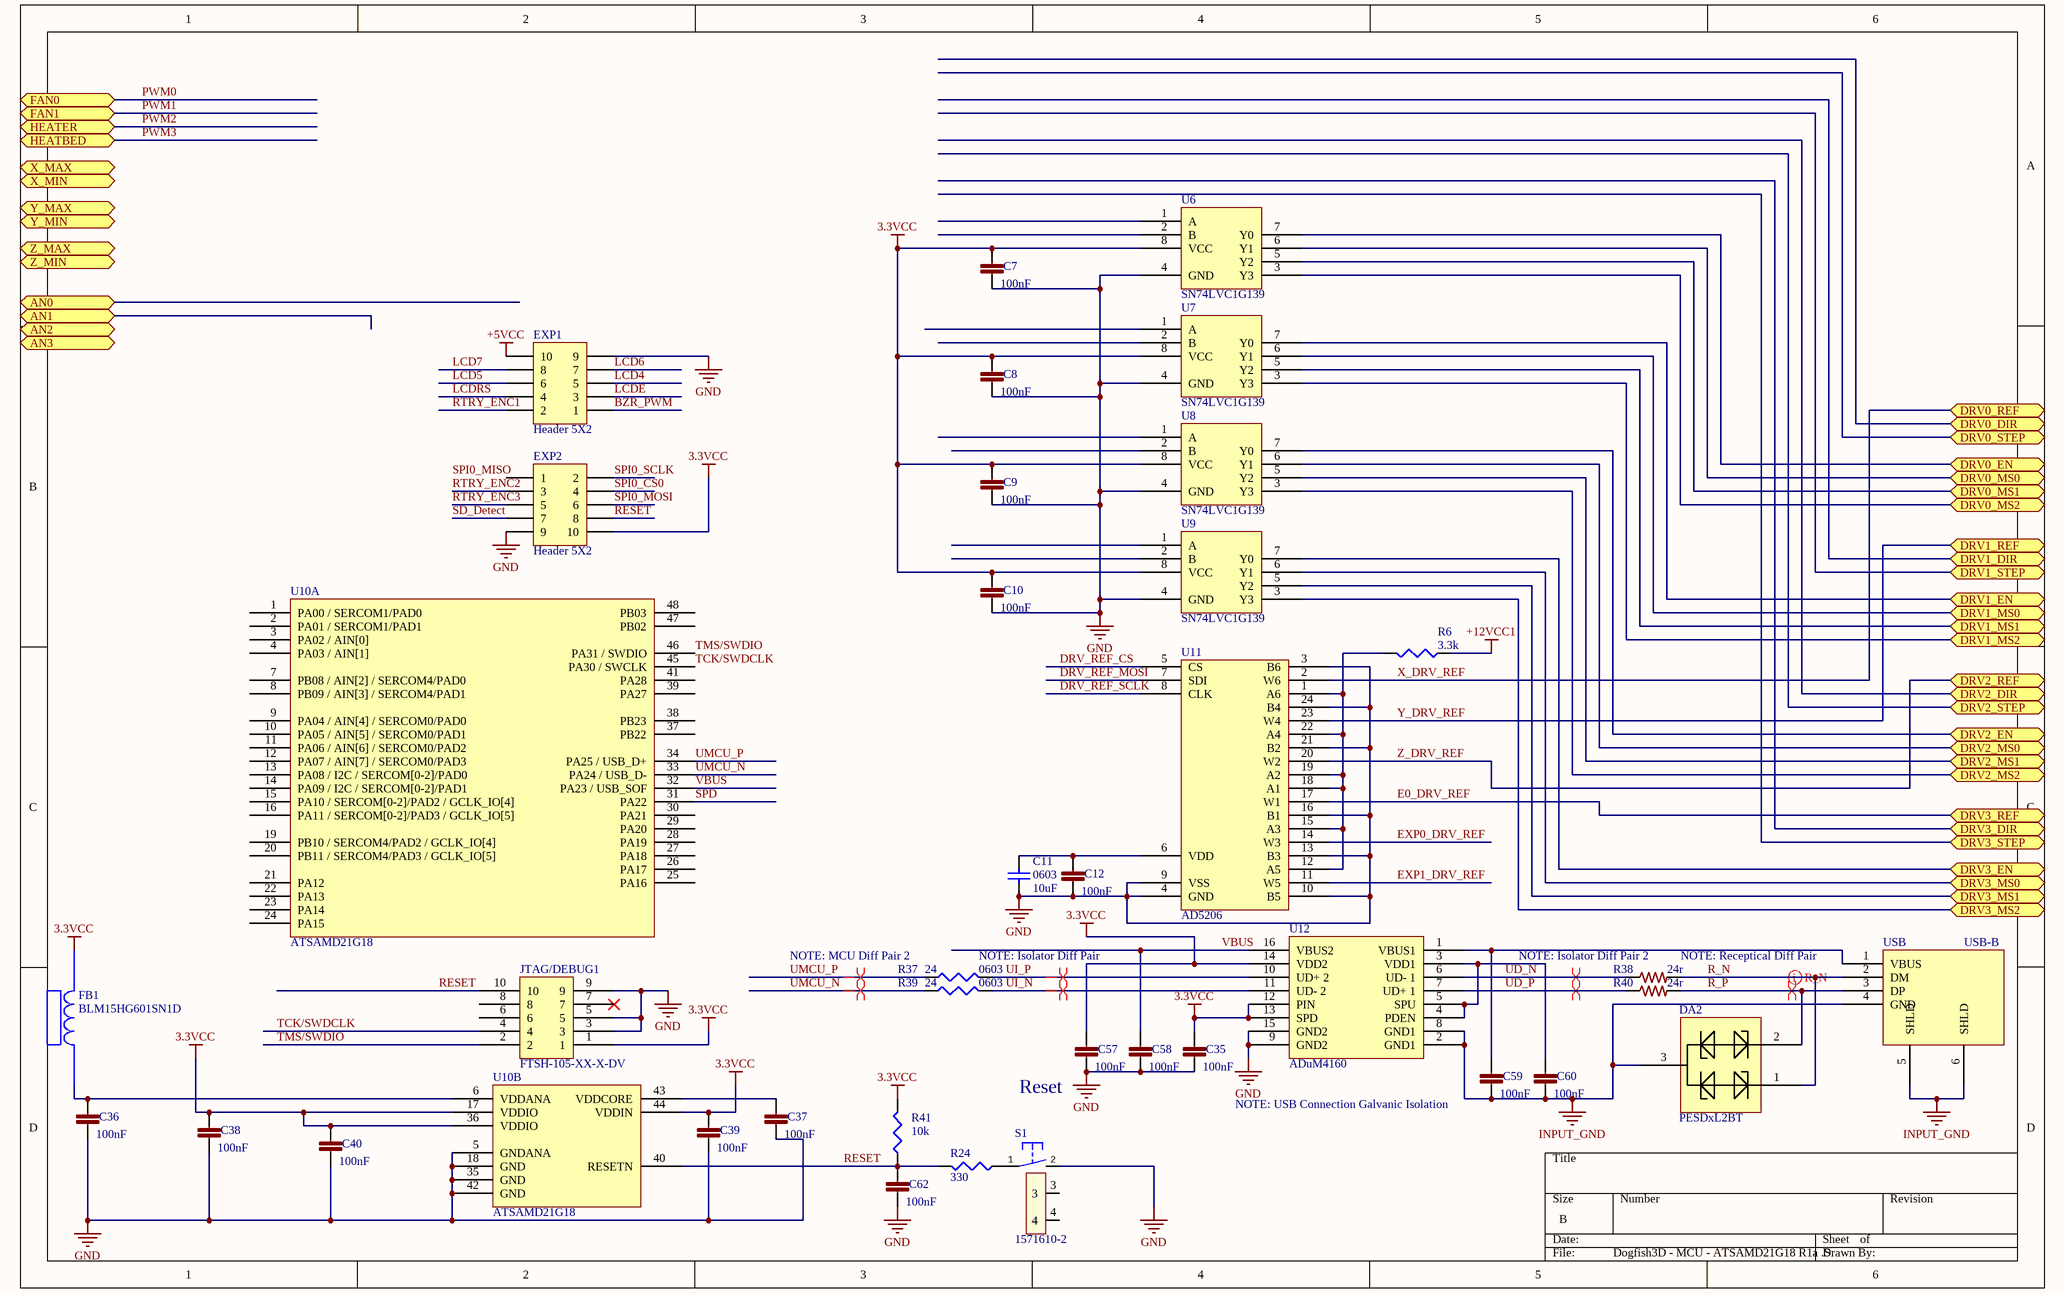
[diagram p6: Dogfish3D - MCU - ATSAMD21G18 R1a .SchDoc]

### Parts
(Parts that share a designator on the sheet are numbered #1, #2 ... from top to bottom, then left to right.)
C7  100nF  [C0402]
C8  100nF  [C0402]
C9  100nF  [C0402]
C10  100nF  [C0402]
C11  0603  value 10uF  [1608[0603]]
C12  100nF  [C0402]
C35#2  100nF  [C0402]
C36#2  100nF  [C0402]
C37#2  100nF  [C0402]
C38#2  100nF  [C0402]
C39#2  100nF  [C0402]
C40#2  100nF  [C0402]
C57  100nF  [C0402]
C58  100nF  [C0402]
C59  100nF  [C0402]
C60  100nF  [C0402]
C62  100nF  [C0402]
DA2  PESDxL2BT  [SOT95P230X110-3N]
EXP1  Header 5X2  [HDR2X5]
EXP2  Header 5X2  [HDR2X5]
FB1  BLM15HG601SN1D  [BLM18PG121SN1D]
JTAG/DEBUG1  FTSH-105-XX-X-DV  [FTSH-105-XX-X-DV]
R6  value 3.3k  [J1-0603]  (hidden comment: Res3)
R24#2  value 330  [J1-0603]  (hidden comment: Res3)
R37  0603  value 24  [J1-0603]
R38  24r  [R0603]
R39  0603  value 24  [J1-0603]
R40  24r  [R0603]
R41  value 10k  [J1-0603]  (hidden comment: Res3)
S1  1571610-2  [B3F-31XX]
U6  SN74LVC1G139  [Ti DCU (R-PDSO-G8) SOIC - SN74VC1G139]
U7  SN74LVC1G139  [Ti DCU (R-PDSO-G8) SOIC - SN74VC1G139]
U8#2  SN74LVC1G139  [Ti DCU (R-PDSO-G8) SOIC - SN74VC1G139]
U9#2  SN74LVC1G139  [Ti DCU (R-PDSO-G8) SOIC - SN74VC1G139]
U10#2  ATSAMD21G18  [TSQFP50P900X900X120-48N]  (parts A,B of 2)
U11  AD5206  [AD5206 & AD5204]
U12  ADuM4160  [ADuM4160]
USB  USB-B  [PN61729]

### Ports
AN0, AN1, AN2, AN3, DRV0_DIR, DRV0_EN, DRV0_MS0, DRV0_MS1, DRV0_MS2, DRV0_REF, DRV0_STEP, DRV1_DIR, DRV1_EN, DRV1_MS0, DRV1_MS1, DRV1_MS2, DRV1_REF, DRV1_STEP, DRV2_DIR, DRV2_EN, DRV2_MS0, DRV2_MS1, DRV2_MS2, DRV2_REF, DRV2_STEP, DRV3_DIR, DRV3_EN, DRV3_MS0, DRV3_MS1, DRV3_MS2, DRV3_REF, DRV3_STEP, FAN0, FAN1, HEATBED, HEATER, X_MAX, X_MIN, Y_MAX, Y_MIN, Z_MAX, Z_MIN

### Nets
3.3VCC: C7.1 C8.1 C9.1 C10.1 C35#2.1 C38#2.1 C39#2.1 C40#2.1 C57.1 EXP2.10 FB1.2 JTAG/DEBUG1.1 R41.2 U6.8(VCC) U7.8(VCC) U8#2.8(VCC) U9#2.8(VCC) U10#2.17(VDDIO) U10#2.36(VDDIO) U10#2.44(VDDIN) U12.12(PIN) U12.13(SPD) U12.14(VDD2)
+5VCC: EXP1.10
+12VCC1: R6.1
GND: C7.2 C8.2 C9.2 C10.2 C11.1 C12.2 C35#2.2 C36#2.2 C37#2.2 C38#2.2 C39#2.2 C40#2.2 C57.2 C58.2 C62.2 EXP1.9 EXP2.9 JTAG/DEBUG1.3 JTAG/DEBUG1.5 JTAG/DEBUG1.9 S1.2(S) U6.4(GND) U7.4(GND) U8#2.4(GND) U9#2.4(GND) U10#2.5(GNDANA) U10#2.18(GND) U10#2.35(GND) U10#2.42(GND) U11.3(B6) U11.4(GND) U11.9(VSS) U11.10(B5) U11.13(B3) U11.16(B1) U11.21(B2) U11.24(B4) U12.9(GND2) U12.15(GND2)
INPUT_GND: C59.2 C60.2 DA2.3 U12.2(GND1) U12.8(GND1) USB.4(GND) USB.5(SHLD) USB.6(SHLD)
BZR_PWM: EXP1.1
DRV_REF_CS: U11.5(CS)
DRV_REF_MOSI: U11.7(SDI)
DRV_REF_SCLK: U11.8(CLK)
E0_DRV_REF: U11.17(W1) ; port DRV3_REF
EN1: U6.7(Y0) ; port DRV0_EN
EN2: U7.7(Y0) ; port DRV1_EN
EN3: U8#2.7(Y0) ; port DRV2_EN
EN4: U9#2.7(Y0) ; port DRV3_EN
EXP0_DRV_REF: U11.14(W3)
EXP1_DRV_REF: U11.11(W5)
LCD4: EXP1.5
LCD5: EXP1.6
LCD6: EXP1.7
LCD7: EXP1.8
LCDE: EXP1.3
LCDRS: EXP1.4
MOD0E1: U6.6(Y1) ; port DRV0_MS0
MOD0E2: U7.6(Y1) ; port DRV1_MS0
MOD0E3: U8#2.6(Y1) ; port DRV2_MS0
MOD0E4: U9#2.6(Y1) ; port DRV3_MS0
MOD1E1: U6.5(Y2) ; port DRV0_MS1
MOD1E2: U7.5(Y2) ; port DRV1_MS1
MOD1E3: U8#2.5(Y2) ; port DRV2_MS1
MOD1E4: U9#2.5(Y2) ; port DRV3_MS1
MOD2E1: U6.3(Y3) ; port DRV0_MS2
MOD2E2: U7.3(Y3) ; port DRV1_MS2
MOD2E3: U8#2.3(Y3) ; port DRV2_MS2
MOD2E4: U9#2.3(Y3) ; port DRV3_MS2
R_N: DA2.1 R38.2 USB.2(DM)
R_P: DA2.2 R40.2 USB.3(DP)
RESET: C62.1 EXP2.8 JTAG/DEBUG1.10 R24#2.2 R41.1 U10#2.40(RESETN)
RTRY_ENC1: EXP1.2
RTRY_ENC2: EXP2.3
RTRY_ENC3: EXP2.5
SD_Detect: EXP2.7
SPD: U10#2.31(PA22)
SPI0_CS0: EXP2.4
SPI0_MOSI: EXP2.6
SPI0_SCLK: EXP2.2
TCK/SWDCLK: JTAG/DEBUG1.4 U10#2.45(PA30_/_SWCLK)
TMS/SWDIO: JTAG/DEBUG1.2 U10#2.46(PA31_/_SWDIO)
UD_N: R38.1 U12.6(UD-_1)
UD_P: R40.1 U12.7(UD+_1)
UI_N: R39.2 U12.11(UD-_2)
UI_P: R37.2 U12.10(UD+_2)
UMCU_N: R39.1 U10#2.33(PA24_/_USB_D-)
UMCU_P: R37.1 U10#2.34(PA25_/_USB_D+)
VBUS: C58.1 U10#2.32(PA23_/_USB_SOF) U12.16(VBUS2)
X_DRV_REF: U11.2(W6) ; port DRV0_REF  [project net REF1]
Y_DRV_REF: U11.23(W4) ; port DRV1_REF  [project net REF2]
Z_DRV_REF: U11.20(W2) ; port DRV2_REF  [project net REF3]
NetC11_2: C11.2 C12.1 U11.6(VDD)
NetC36#2_1: C36#2.1 FB1.1 U10#2.6(VDDANA)
NetC37#2_1: C37#2.1 U10#2.43(VDDCORE)
NetC59_1: C59.1 U12.1(VBUS1) USB.1(VBUS)
NetC60_1: C60.1 U12.3(VDD1) U12.4(PDEN) U12.5(SPU)
NetR6_2: R6.2 U11.1(A6) U11.12(A5) U11.15(A3) U11.18(A1) U11.19(A2) U11.22(A4)
NetR24#2_1: R24#2.1 S1.1(P)

Not connected (* = marked no-connect by the designer): EXP2 1; JTAG/DEBUG1 6 7* 8; S1 3 4; U6 1(A) 2(B); U7 1(A) 2(B); U8#2 1(A) 2(B); U9#2 1(A) 2(B); U10#2 1(PA00_/_SERCOM1/PAD0) 2(PA01_/_SERCOM1/PAD1) 3(PA02_/_AIN[0]) 4(PA03_/_AIN[1]) 7(PB08_/_AIN[2]_/_SERCOM4/PAD0) 8(PB09_/_AIN[3]_/_SERCOM4/PAD1) 9(PA04_/_AIN[4]_/_SERCOM0/PAD0) 10(PA05_/_AIN[5]_/_SERCOM0/PAD1) 11(PA06_/_AIN[6]_/_SERCOM0/PAD2) 12(PA07_/_AIN[7]_/_SERCOM0/PAD3) 13(PA08_/_I2C_/_SERCOM[0-2]/PAD0) 14(PA09_/_I2C_/_SERCOM[0-2]/PAD1) 15(PA10_/_SERCOM[0-2]/PAD2_/_GCLK_IO[4]) 16(PA11_/_SERCOM[0-2]/PAD3_/_GCLK_IO[5]) 19(PB10_/_SERCOM4/PAD2_/_GCLK_IO[4]) 20(PB11_/_SERCOM4/PAD3_/_GCLK_IO[5]) 21(PA12) 22(PA13) 23(PA14) 24(PA15) 25(PA16) 26(PA17) 27(PA18) 28(PA19) 29(PA20) 30(PA21) 37(PB22) 38(PB23) 39(PA27) 41(PA28) 47(PB02) 48(PB03)

### Layout directives
differential pair: R_N, R_P, UD_N, UD_P, UI_N, UI_P, UMCU_N, UMCU_P

### Notes on the sheet
- NOTE: MCU Diff Pair 2
- (near R37) NOTE: Isolator Diff Pair
- (near R38) NOTE: Isolator Diff Pair 2
- NOTE: Receptical Diff Pair
- (near C57) Reset
- (near C59) NOTE: USB Connection Galvanic Isolation
- Labels drawn without touching a wire or pin: SPI0_MISO

### Library data of the parts
C7-C10 C12 C35#2 C36#2 C37#2 C38#2 C39#2 C40#2 C57-C60 C62 = GRM155R71C104KA88D: CAP CER 0402 100nF 16V 10% X7R; LastRevisionNote: ImportComponents; Published: 23-Apr-2014; Publisher: UltiMachine; LastRevisionDate: 23-Apr-2014; ManufacturerPartNumber: GRM155R71C104KA88D; VALUE: 100nF
C11 = Cap Semi: Capacitor (Semiconductor SIM Model); Published: 8-Jun-2000; LatestRevisionDate: 29-May-2009; LatestRevisionNote: IPC-7351 Footprint Added.; PackageReference: C1206; Publisher: Altium Limited; PackageDescription: Chip Capacitor
DA2 = PESDxL2BT: PESDxL2BT TVS Diode Array 2x
EXP1 EXP2 = Header 5X2: Header, 5-Pin, Dual row; LatestRevisionDate: 17-Jul-2002; LatestRevisionNote: Re-released for DXP Platform.; Publisher: Altium Limited
JTAG/DEBUG1 = ARM Cortex JTAG-DEBUG Header
R6 R24#2 R37 R39 R41 = Res3: Resistor; Published: 8-Jun-2000; LatestRevisionDate: 29-May-2009; LatestRevisionNote: IPC-7351 Footprint Added.; PackageReference: J1-0603; Publisher: Altium Limited; PackageDescription: Chip Resistor
R38 R40 = RC1608F240CS: RES SMD 24 OHM 1% 1/10W 0603; Manufacturer: Samsung; ManufacturerPartNumber: RC0603FR-07100KL; LastRevisionNote: ImportComponents; Published: 23-Apr-2014; Publisher: UltiMachine; LastRevisionDate: 23-Apr-2014; VALUE: 24r; PDF: http://www.samsungsem.com/global/support/library/product-catalog/__icsFiles/afieldfile/2015/01/12/CHIP_RESISTOR_150112_1.pdf
S1 = 1571610-2_1: SWTCH Momentary Washable; Manufacturer: Omron; Manufacturer: TE; LastRevisionNote: Import; ComponentLink1URL: http://www.te.com/commerce/DocumentDelivery/DDEController?Action=srchrtrv&DocNm=1571610&DocType=Customer+Drawing&DocLang=English; ComponentLink1Description: Datasheet for B3F-31XX; Published: 23-Apr-2014; Publisher: UltiMachine; LastRevisionDate: 23-Apr-2014; ManufacturerPartNumber: 1571610-2; Supplier 1: Mouser; Supplier Part Number 1: 506-1571610-2
U12 = ADuM4160: USB Opto Isolator

## Nets that join several sheets
3.3VCC: Dogfish3D - Driver Channel1 (U7A.16 U7A.17), Dogfish3D - Driver Channel2 (U7B.16 U7B.17), Dogfish3D - Driver Channel3 (U7C.16 U7C.17), Dogfish3D - Driver Channel4 (U7D.16 U7D.17), U_Dogfish3D - Endstop Channel1 (MAX1A.3 MIN1A.3 R4A.1 R5A.1), U_Dogfish3D - Endstop Channel2 (MAX1B.3 MIN1B.3 R4B.1 R5B.1), U_Dogfish3D - Endstop Channel3 (MAX1C.3 MIN1C.3 R4C.1 R5C.1), Dogfish3D - MOSFETs and Driver (C28.2 C29.2 U8#1.1 U8#1.8), Dogfish3D - Power (5 pins), U_Dogfish3D - Thermistor Channel1 (R19A.2), U_Dogfish3D - Thermistor Channel2 (R19B.2), Dogfish3D - MCU - ATSAMD21G18 R1a  (23 pins)
+5VCC: Dogfish3D - MOSFETs and Driver (C30.2 C31.2 U8#1.14), Dogfish3D - Power (9 pins), Dogfish3D - MCU - ATSAMD21G18 R1a  (EXP1.10)
+12VCC1: Dogfish3D - Driver Channel1 (5 pins), Dogfish3D - Driver Channel2 (5 pins), Dogfish3D - Driver Channel3 (5 pins), Dogfish3D - Driver Channel4 (5 pins), Dogfish3D - Power (5 pins), Dogfish3D - MCU - ATSAMD21G18 R1a  (R6.1)
+12VCC2: Dogfish3D - MOSFETs and Driver (10 pins), Dogfish3D - Power (10 pins)
GND: Dogfish3D - Driver Channel1 (8 pins), Dogfish3D - Driver Channel2 (8 pins), Dogfish3D - Driver Channel3 (8 pins), Dogfish3D - Driver Channel4 (8 pins), U_Dogfish3D - Endstop Channel1 (5 pins), U_Dogfish3D - Endstop Channel2 (5 pins), U_Dogfish3D - Endstop Channel3 (5 pins), Dogfish3D - MOSFETs and Driver (12 pins), Dogfish3D - Power (29 pins), U_Dogfish3D - Thermistor Channel1 (C30A.1 D5A.1 P2A.2), U_Dogfish3D - Thermistor Channel2 (C30B.1 D5B.1 P2B.2), Dogfish3D - MCU - ATSAMD21G18 R1a  (39 pins)
E0_DRV_REF: Dogfish3D - Driver Channel4 (R31D.2 TP33D.1), Dogfish3D - MCU - ATSAMD21G18 R1a  (U11.17)
EN1: Dogfish3D - Driver Channel1 (TP32A.1 U7A.21), Dogfish3D - MCU - ATSAMD21G18 R1a  (U6.7)
EN2: Dogfish3D - Driver Channel2 (TP32B.1 U7B.21), Dogfish3D - MCU - ATSAMD21G18 R1a  (U7.7)
EN3: Dogfish3D - Driver Channel3 (TP32C.1 U7C.21), Dogfish3D - MCU - ATSAMD21G18 R1a  (U8#2.7)
EN4: Dogfish3D - Driver Channel4 (TP32D.1 U7D.21), Dogfish3D - MCU - ATSAMD21G18 R1a  (U9#2.7)
MOD0E1: Dogfish3D - Driver Channel1 (TP37A.1 U7A.24), Dogfish3D - MCU - ATSAMD21G18 R1a  (U6.6)
MOD0E2: Dogfish3D - Driver Channel2 (TP37B.1 U7B.24), Dogfish3D - MCU - ATSAMD21G18 R1a  (U7.6)
MOD0E3: Dogfish3D - Driver Channel3 (TP37C.1 U7C.24), Dogfish3D - MCU - ATSAMD21G18 R1a  (U8#2.6)
MOD0E4: Dogfish3D - Driver Channel4 (TP37D.1 U7D.24), Dogfish3D - MCU - ATSAMD21G18 R1a  (U9#2.6)
MOD1E1: Dogfish3D - Driver Channel1 (TP36A.1 U7A.25), Dogfish3D - MCU - ATSAMD21G18 R1a  (U6.5)
MOD1E2: Dogfish3D - Driver Channel2 (TP36B.1 U7B.25), Dogfish3D - MCU - ATSAMD21G18 R1a  (U7.5)
MOD1E3: Dogfish3D - Driver Channel3 (TP36C.1 U7C.25), Dogfish3D - MCU - ATSAMD21G18 R1a  (U8#2.5)
MOD1E4: Dogfish3D - Driver Channel4 (TP36D.1 U7D.25), Dogfish3D - MCU - ATSAMD21G18 R1a  (U9#2.5)
MOD2E1: Dogfish3D - Driver Channel1 (TP35A.1 U7A.26), Dogfish3D - MCU - ATSAMD21G18 R1a  (U6.3)
MOD2E2: Dogfish3D - Driver Channel2 (TP35B.1 U7B.26), Dogfish3D - MCU - ATSAMD21G18 R1a  (U7.3)
MOD2E3: Dogfish3D - Driver Channel3 (TP35C.1 U7C.26), Dogfish3D - MCU - ATSAMD21G18 R1a  (U8#2.3)
MOD2E4: Dogfish3D - Driver Channel4 (TP35D.1 U7D.26), Dogfish3D - MCU - ATSAMD21G18 R1a  (U9#2.3)
NetD3A_2: Dogfish3D - Power (D10.2 R31.1 TP17.1), U_Dogfish3D - Thermistor Channel1 (D3A.2), U_Dogfish3D - Thermistor Channel2 (D3B.2)
REF1: Dogfish3D - Driver Channel1 (R31A.2 TP33A.1), Dogfish3D - MCU - ATSAMD21G18 R1a  (U11.2)
REF2: Dogfish3D - Driver Channel2 (R31B.2 TP33B.1), Dogfish3D - MCU - ATSAMD21G18 R1a  (U11.23)
REF3: Dogfish3D - Driver Channel3 (R31C.2 TP33C.1), Dogfish3D - MCU - ATSAMD21G18 R1a  (U11.20)